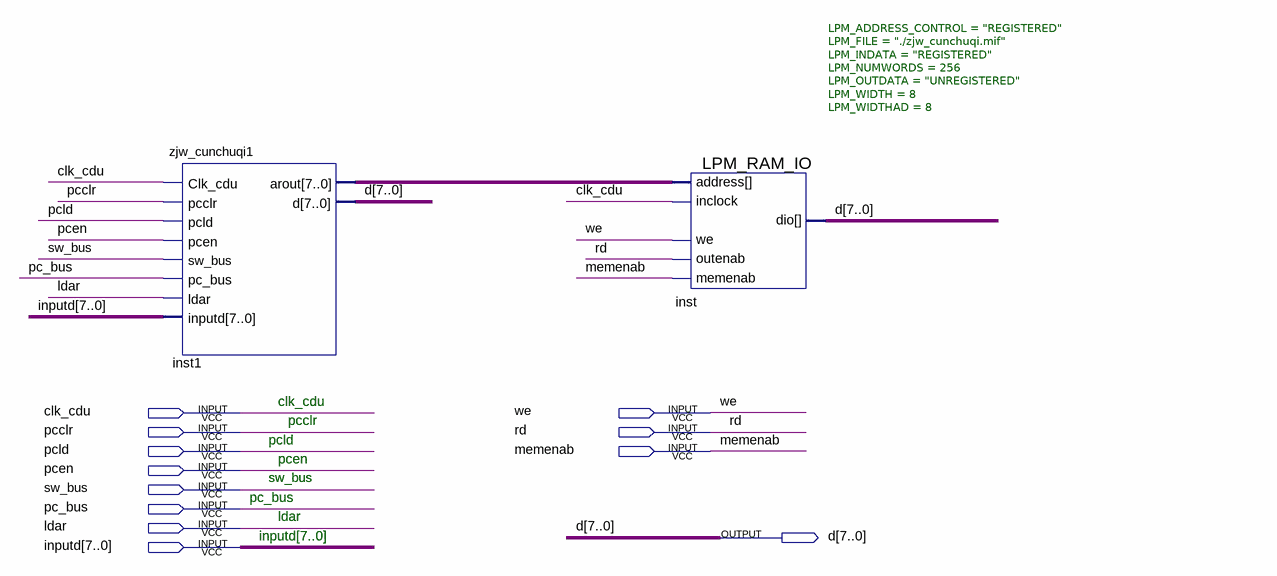
[diagram p0: schematic sheet]
// Quartus schematic zjw_cunchuqi.bdf as structural Verilog: 2 symbols, 12 pins
module zjw_cunchuqi (
  input  clk_cdu,
  input  we,
  input  pcclr,
  input  rd,
  input  pcld,
  input  memenab,
  input  pcen,
  input  sw_bus,
  input  pc_bus,
  input  ldar,
  input  [7:0] inputd,
  output [7:0] d
);

  wire [7:0] inst1_arout;

  zjw_cunchuqi1 inst1 (
    .Clk_cdu(clk_cdu), .pcclr(pcclr), .pcld(pcld), .pcen(pcen), .sw_bus(sw_bus), .pc_bus(pc_bus),
    .ldar(ldar), .inputd(inputd), .arout(inst1_arout), .d(d));
  LPM_RAM_IO #(.LPM_ADDRESS_CONTROL("REGISTERED"), .LPM_FILE("./zjw_cunchuqi.mif"), .LPM_INDATA("REGISTERED"), .LPM_NUMWORDS(256), .LPM_OUTDATA("UNREGISTERED"), .LPM_WIDTH(8), .LPM_WIDTHAD(8)) inst (
    .address(inst1_arout), .memenab(memenab), .inclock(clk_cdu), .we(we), .outenab(rd), .dio(d));

  // Notes on the sheet:
  //   clk_cdu
  //   pcclr
  //   pcld
  //   pcen
  //   sw_bus
  //   pc_bus
  //   ldar
  //   inputd[7..0]
endmodule
